# EAGLE design Micromirror_Ampli_PCB (EAGLE 9.2.2)
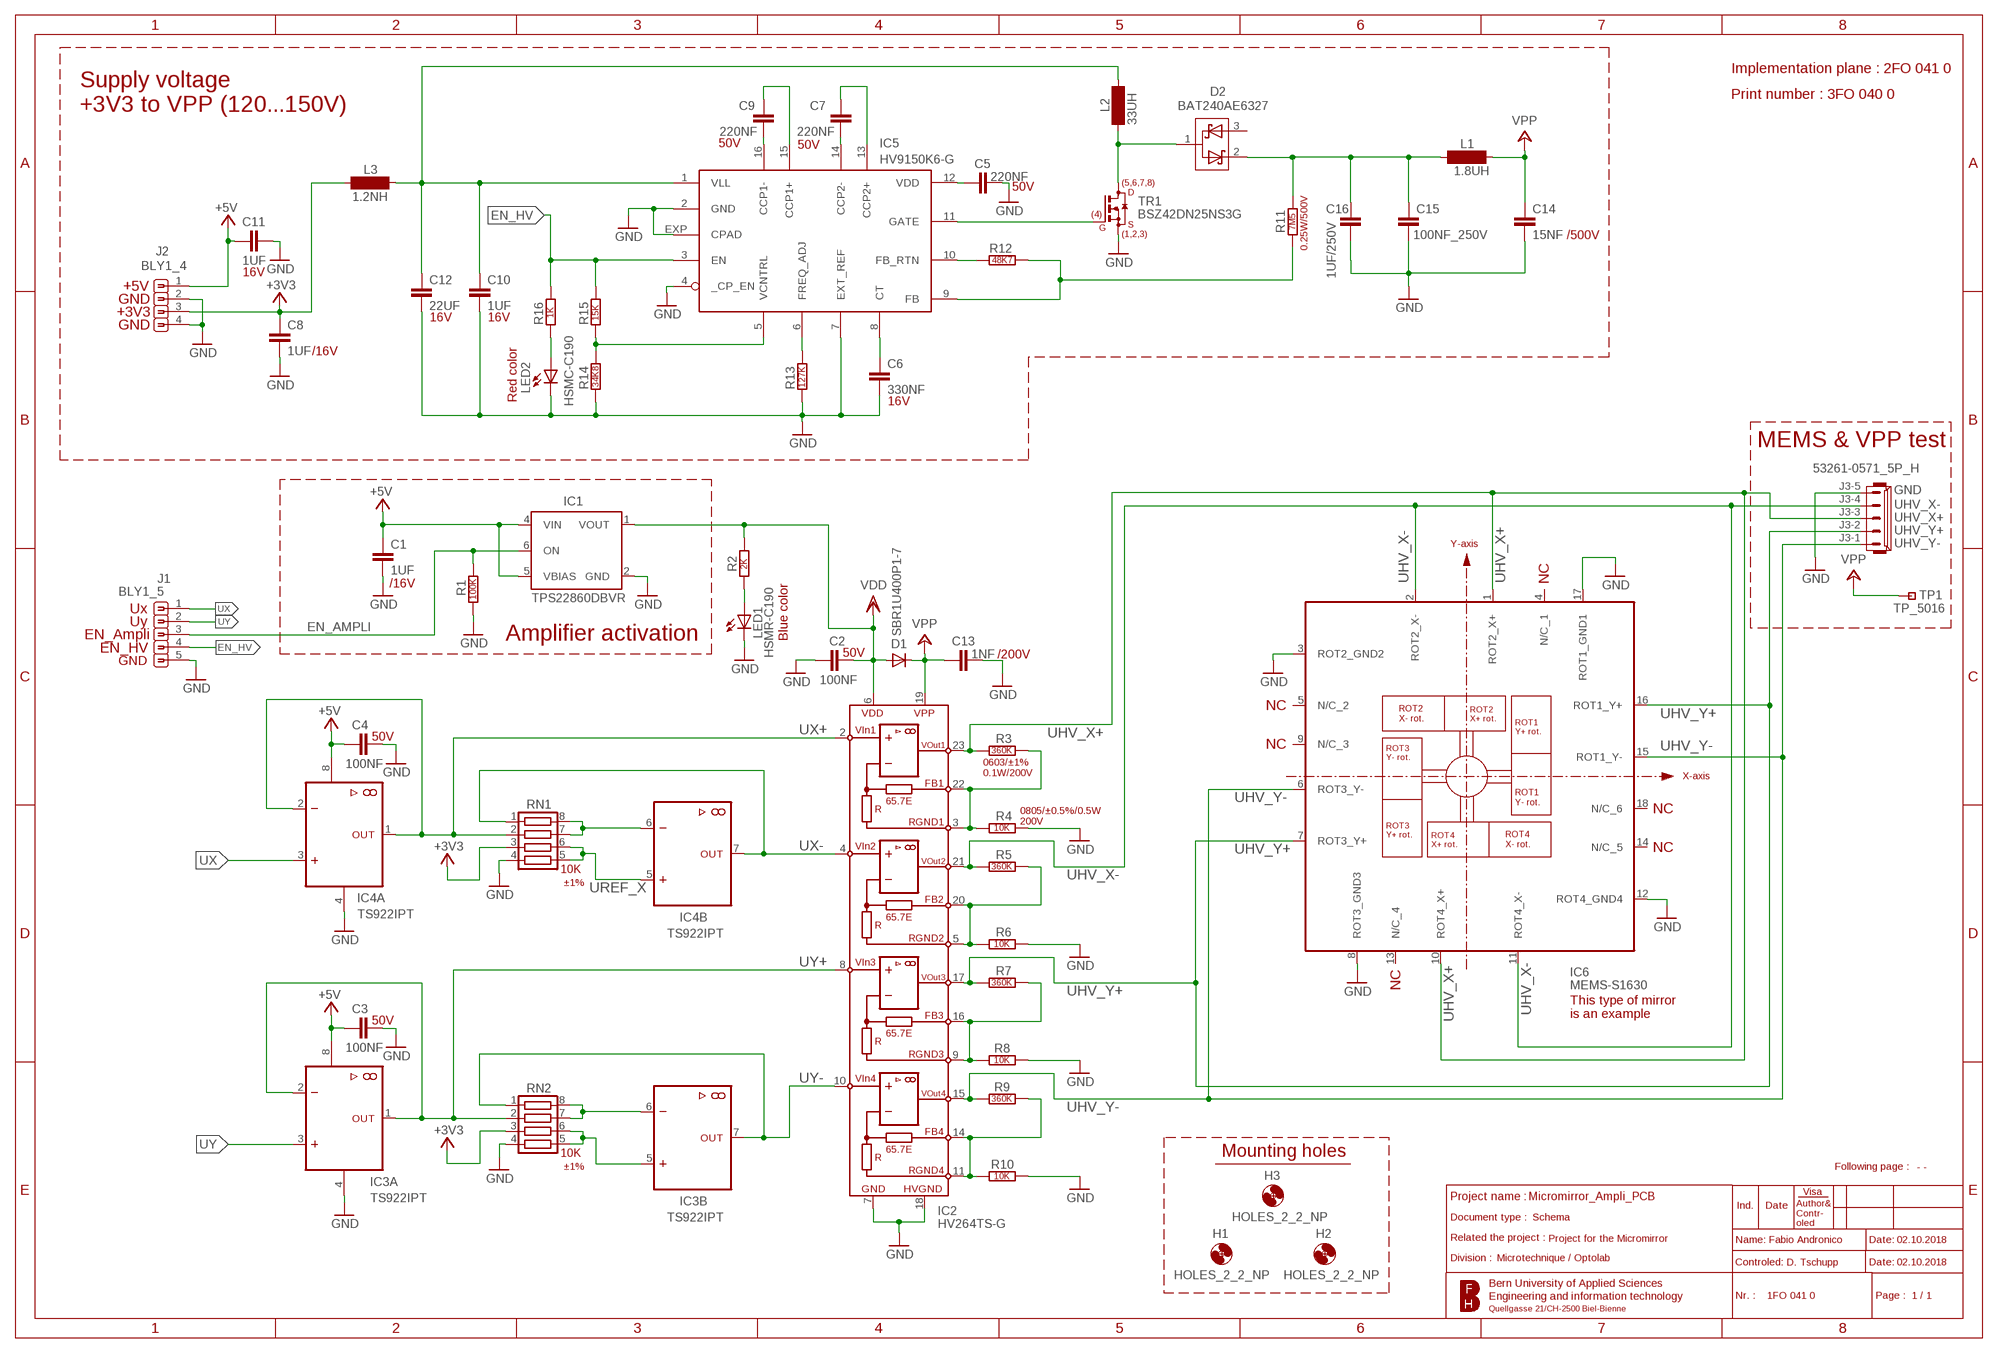
[diagram p0: schematic, sheet 1]

## Parts
C1  1UF  [C0603]
C2  100NF  [C0603]
C3  100NF  [C0603]
C4  100NF  [C0603]
C5  220NF  [C0603]
C6  330NF  [C0603]
C7  220NF  [C0603]
C8  1UF  [C0603]
C9  220NF  [C0603]
C10  1UF  [C0603]
C11  1UF  [C0603]
C12  22UF  [C0805]
C13  1NF  [C0603]
C14  15NF  [C0805]
C15  100NF_250V  [C0805]
C16  1UF/250V  [C1812]
D1  SBR1U400P1-7  [POWERDI_123]
D2  BAT240AE6327  [SOT23-3]
H1  HOLES_2_2_NP  [2_2_NP]
H2  HOLES_2_2_NP  [2_2_NP]
H3  HOLES_2_2_NP  [2_2_NP]
IC1  TPS22860DBVR  [SOT23-6]
IC2  HV264TS-G  [TSSOP24]
IC3  TS922IPT  [TSSOP8]
IC4  TS922IPT  [TSSOP8]
IC5  HV9150K6-G  [QFN16]
IC6  MEMS-S1630  [LCC18]
J1  BLY1_5  [BLY1_5_2MM]
J2  BLY1_4  [BLY1_4_2MM]
J3  53261-0571_5P_H  [53261-05]
L1  1.8UH  [L0805]
L2  33UH  [NR5040]
L3  1.2NH  [L08051R2CEWTR]
LED1  HSMR-C190  [CHIP-LED-0603]
LED2  HSMC-C190  [CHIP-LED-0603]
R1  100K  [R0603]
R2  2K  [R0603]
R3  360K  [R0603]
R4  10K_0.5%  [R0805]
R5  360K  [R0603]
R6  10K_0.5%  [R0805]
R7  360K  [R0603]
R8  10K_0.5%  [R0805]
R9  360K  [R0603]
R10  10K_0.5%  [R0805]
R11  7M5  [R1206]
R12  48K7  [R0603]
R13  127K  [R0603]
R14  34K8  [R0603]
R15  15K  [R0603]
R16  1K_0.1W  [R0603]
RN1  10K  [RN1206]
RN2  10K  [RN1206]
TP1  TP_5016  5016  [5016]
TR1  BSZ42DN25NS3G  [TSDSON-8]

## Nets
+3V3: C8.1 J2.3 L3.1 RN1.3 RN2.3
+5V: C1.1 C3.1 C4.1 C11.1 IC1.4(VIN) IC1.5(VBIAS) IC3.8(P:+5V) IC4.8(P:+5V) J2.1
EN_AMPLI: IC1.6(ON) J1.3 R1.1
EN_HV: IC5.3(EN) J1.4 R15.2 R16.2
GND: C1.2 C2.2 C3.2 C4.2 C5.1 C6.2 C8.2 C10.2 C11.2 C12.2 C13.2 C14.2 C15.2 C16.2 IC1.2(GND) IC2.7(GND) IC2.18(HVGND) IC3.4(P:GND) IC4.4(P:GND) IC5.2(GND) IC5.4(_CP_EN) IC5.7(EXT_REF) IC5.EXP(CPAD) IC6.3(ROT2_GND2) IC6.8(ROT3_GND3) IC6.12(ROT4_GND4) IC6.17(ROT1_GND1) J1.5 J2.2 J2.4 J3.5 LED1.C LED2.C R1.2 R4.2 R6.2 R8.2 R10.2 R13.1 R14.1 RN1.4 RN2.4 TR1.1(S) TR1.2(S) TR1.3(S)
N$1: IC5.11(GATE) TR1.4(G)
N$2: C9.1 IC5.16(CCP1-)
N$3: C9.2 IC5.15(CCP1+)
N$4: C7.2 IC5.14(CCP2-)
N$5: C7.1 IC5.13(CCP2+)
N$6: C5.2 IC5.12(VDD)
N$7: IC5.5(VCNTRL) R14.2 R15.1
N$8: IC5.6(FREQ_ADJ) R13.2
N$9: C6.1 IC5.8(CT)
N$10: D2.1 L2.1 TR1.5(D)
N$11: IC5.10(FB_RTN) R12.1
N$12: C15.1 C16.1 D2.2 L1.1 R11.2
N$13: IC5.9(FB) R11.1 R12.2
N$14: IC3.6(B:-IN) RN2.7 RN2.8
N$15: IC3.5(B:+IN) RN2.5 RN2.6
N$16: LED2.A R16.1
N$17: IC2.3(RGND1) IC2.22(FB1) R3.2 R4.1
N$18: IC4.6(B:-IN) RN1.7 RN1.8
N$19: IC2.5(RGND2) IC2.20(FB2) R5.2 R6.1
N$20: LED1.A R2.1
N$21: C10.1 C12.1 IC5.1(VLL) L2.2 L3.2
N$22: IC2.9(RGND3) IC2.16(FB3) R7.2 R8.1
N$23: IC2.11(RGND4) IC2.14(FB4) R9.2 R10.1
UHV_X+: IC2.23(VOUT1) IC6.1(ROT2_X+) IC6.10(ROT4_X+) J3.3 R3.1
UHV_X-: IC2.21(VOUT2) IC6.2(ROT2_X-) IC6.11(ROT4_X-) J3.4 R5.1
UHV_Y+: IC2.17(VOUT3) IC6.7(ROT3_Y+) IC6.16(ROT1_Y+) J3.2 R7.1
UHV_Y-: IC2.15(VOUT4) IC6.6(ROT3_Y-) IC6.15(ROT1_Y-) J3.1 R9.1
UREF_X: IC4.5(B:+IN) RN1.5 RN1.6
UX: IC4.3(A:+IN) J1.1
UX+: IC2.2(+VIN1) IC4.1(A:OUT) IC4.2(A:-IN) RN1.2
UX-: IC2.4(+VIN2) IC4.7(B:OUT) RN1.1
UY: IC3.3(A:+IN) J1.2
UY+: IC2.8(+VIN3) IC3.1(A:OUT) IC3.2(A:-IN) RN2.2
UY-: IC2.10(+VIN4) IC3.7(B:OUT) RN2.1
VDD: C2.1 D1.A IC1.1(VOUT) IC2.6(VDD) R2.2
VPP: C13.1 C14.1 D1.C IC2.19(VPP) L1.2 TP1.1(P)
Unconnected: D2.3 IC1.3(NC) IC2.1(NC) IC2.12(NC) IC2.13(NC) IC2.24(NC) IC6.4(N/C_1) IC6.5(N/C_2) IC6.9(N/C_3) IC6.13(N/C_4) IC6.14(N/C_5) IC6.18(N/C_6)

## Notes on the sheet
- Implementation plane : 2FO 041 0
- Print number : 3FO 040 0
- Supply voltage
  +3V3 to VPP (120...150V)
- 50V | 50V
- 50V
- /500V
- 0.25W/500V
- 16V
- +5V
- GND
- +3V3
- 16V | 16V
- GND
- /16V
- Red color | 16V
- MEMS & VPP test
- NC
- /16V
- Ux
- Uy
- EN_Ampli | Amplifier activation | Blue color
- EN_HV
- 50V | /200V
- GND
- NC
- 50V
- NC
- 0603/±1%
  0.1W/200V
- NC
- 0805/±0.5%/0.5W
  200V
- NC
- ±1%
- NC
- This type of mirror
  is an example
- 50V
- Mounting holes
- ±1% | - -
- Project for the Micromirror | Fabio Andronico | 02.10.2018
- Microtechnique / Optolab
- D. Tschupp | 02.10.2018
- 1FO 041 0 | 1 / 1

## Library data of the parts
C1 C8 C10 C11 = Micromirror_Ampli_PCB:1UF: Multilayer Ceramic Capacitor, MLCC, 1uF ±5%, 16VDC, X7R, KEMET , Case 0603, Mouser: 80-C0603X105J4R; CASE: 0603; CERAMIC: X7R; FARNELL: 2860291; MANUFACTURER: KEMET; MOUSER: 80-C0603X105J4R; OPERATING_TEMPERATURE_RANGE: -55°C ~ 125°C; TOLERANCE: ±5%; TYPE: C0603X105J4RACTU; U_NOM: 16V
C2-C4 = Micromirror_Ampli_PCB:100NF: Multilayer Ceramic Capacitors MLCC, SMD 100nF ±10%, 50VDC, X7R, Kemet, Case 0603, Mouser: 80-C0603X104K5RAUTO; CASE: 0603; CERAMIC: X7R; DIGI-KEY: 399-6912-1-ND; DISTRELEC: 300-31-697; MANUFACTURER: Kemet; MOUSER: 80-C0603X104K5RAUTO; OPERATING_TEMPERATURE_RANGE: -55°C ~ 125°C; TOLERANCE: ±10%; TYPE: C0603X104K5RACAUTO; U_NOM: 50V
C5 C7 C9 = Micromirror_Ampli_PCB:220NF: Multilayer ceramic capacitor SMD, 220nF, ±10%, 50VDC, X7R, Murata, Case 0603, Mouser: 81-GCJ188R71H224KA1D; CASE: 0603; CERAMIC: X7R; DIGI-KEY: 490-14410-1-ND; MANUFACTURER: Murata; MOUSER: 81-GCJ188R71H224KA1D; OPERATING_TEMPERATURE_RANGE: -55°C ~ 125°C; TOLERANCE: ±10%; TYPE: GCJ188R71H224KA01D; U_NOM: 50V
C6 = Micromirror_Ampli_PCB:330NF: Ceramic capacitor SMD 330nF ±10%, 16VDC, X7R, AVX, Case 0603, Mouser: 581-0603YC334KAT2A; CASE: 0603; CERAMIC: X7R; DIGI-KEY: 478-10817-1-ND; MANUFACTURER: AVX; MOUSER: 581-0603YC334KAT2A; OPERATING_TEMPERATURE_RANGE: -55°C ~ 125°C; TOLERANCE: ±10%; TYPE: 0603YC334KAT2A; U_NOM: 16V
C12 = Micromirror_Ampli_PCB:22UF: Multilayer ceramic capacitor MLCC, SMD, 22uF, ±20%, 16VDC, X5R, Murata, Case 0805, Mouser : 81-GRM219R61C226ME5L; CASE: 0805; CERAMIC: X5R; DIGI-KEY: 490-9952-1-ND; FARNELL: 2611932; MANUFACTURER: Murata; MOUSER: 81-GRM219R61C226ME5L; OPERATING_TEMPERATURE_RANGE: -55°C ~ 85°C; TOLERANCE: ±20%; TYPE: GRM219R61C226ME15L; U_NOM: 16VDC
C13 = Micromirror_Ampli_PCB:1NF: Ceramic capacitor SMD 1nF ±5%, 200VDC, COG, Kemet, Case 0603, Mouser:80-C0603X102J2GAUTO; CASE: 0603; CERAMIC: COG/NPO; DIGI-KEY: 399-11586-1-ND; FARNELL: 2426913; MANUFACTURER: Kemet; MOUSER: 80-C0603X102J2GAUTO; OPERATING_TEMPERATURE_RANGE: -55°C ~ 125°C; TOLERANCE: ±5%; TYPE: C0603X102J2GACAUTO; U_NOM: 200V
C14 = Micromirror_Ampli_PCB:15NF: Multilayer ceramic capacitor MLCC-SMD, 15nF, ±5%, 500VDC, X7R , Kemet, Case 0805, Mouser : 80-C0805W153JCRACTU; CASE: 0805; CERAMIC: X7R; MANUFACTURER: Kemet; MOUSER: 80-C0805W153JCRACTU; OPERATING_TEMPERATURE_RANGE: -55°C ~ 125°C; TOLERANCE: ±5%; TYPE: C0805W153JCRACTU; U-NOM: 500V
C15 = Micromirror_Ampli_PCB:100NF_250V: Multilayer Ceramic Capacitors MLCC, SMD 100nF ±20%, 250VDC, X7T, TDK, Case 0805, Mouser : 810-C2012X7T2E104MST; CASE: 0805; CERAMIC: X7T; FARNELL: 2576758; MANUFACTURER: TDK; MOUSER: 810-C2012X7T2E104MST; OPERATING_TEMPERATURE_RANGE: -55...+125°C; TOLERANCE: ±20%; TYPE: C2012X7T2E104M125AE; U_NOM: 250V
C16 = Micromirror_Ampli_PCB:1UF/250V: Multilayer ceramic capacitor MLCC-SMD, 1uF ±10%, 250VDC, X7T, Murata, Case 1812, Mouser : 810-C4532X7T2E105KKA; CASE: 1812; DIELECTRIC: X7T; DIGI-KEY: 445-7769-1-ND; FARNELL: 2525209; MANUFACTURER: TDK; MOUSER: 810-C4532X7T2E105KKA; OPERATING-TEMPERATURE: -55°C ~ 125°C; TOLERANCE: ±10%; TYPE: C4532X7T2E105K250KA; VOLTAGE-RATING: 250 VDC
D1 = Micromirror_Ampli_PCB:SBR1U400P1-7: Schottky Diodes & Rectifiers SBRULTRA LOW VF 1A400V, Diodes Incorporated, Mouser : 621-SBR1U400P1-7; DIGI-KEY: SBR1U400P1-7DICT-ND; FARNELL: 1863727; IF: 1A; MAX_SURGE_CURRENT: 40A; MOUSER: 621-SBR1U400P1-7; OPERATING_TEMPERATURE: -65°C à +175°C; PEAK_REVERSE_VOLTAGE: 400V; RECOVERY_TIME: 85 ns; VF: 820mV
D2 = Micromirror_Ampli_PCB:BAT240AE6327: Schottky Diodes & Rectifiers, Hi Voltage Schottky Diode, 240V, 400mA, Infineon, Mouser : 726-BAT240AE6327; CASE: SOT23-3; CONFIGURATION: Dual Series; DIGI-KEY: BAT240AE6327HTSA1CT-ND; FARNELL: 2443529; IF: 0.4A; IFSM: 1A; IR: 10 uA at 100 V; MANUFACTURER: Infineon; MOUSER: 726-BAT240AE6327; OPERATING-TEMPERATURE: -55...+125°C; PRODUCT_TYPE: Schottky Diodes & Rectifiers; TECHNOLOGY: SI; TYPE: BAT 240A E6327; VF: 0.52V; VRM: 240V
H1-H3 = Micromirror_Ampli_PCB:HOLES_2_2_NP: Hole D = 2,2mm
IC1 = Micromirror_Ampli_PCB:TPS22860: Power Switch ICs - Power Distribution Dual Slot Power Interface, SOT-23-6, Texas Instruments, Mouser : 595-TPS22860DBVR; BIAS-VOLTAGE-RANGE: 1,65 to 5,5V; CASE: SOT-23-6; DIGI-KEY: 296-43982-1-ND; MANUFACTURER: Texas Instruments; MAX-CONTINUOUS_SWITCH-CURRENT: 200mA; MOUSER: 595-TPS22860DBVR; R-ON-5V: 0,73 Ohms
IC2 = Micromirror_Ampli_PCB:HV264TS-G: Op Amps Quad High Voltage Amplifier Array IC, HV264TS-G, Case TSSOP-24, Mouser : 689-HV264TS-G; CASE: TSSOP-24; INPUT_BIAS_CURRENT_MAX: 50 nA; MANUFACTURER: Supertex; MAX_MIN_OPERATING-TEMP: -40C to +85C; MOUSER: 689-HV264TS-G; NUMBER_OF_CHANNEL: 4; OPERATING_SUPPLY_VOLTAGE: 5V; SLEW_RATE: 9 V/us
IC3 IC4 = Micromirror_Ampli_PCB:TS922: STMicroelectronics - TS922IxT , Operational Amplifier, Rail-to-Rail, Dual 2,7 V ~ 12 V, DIgi-Key : 497-6619-1-ND (TSSOP8), DIgi-Key : 497-6035-1-ND (SO8); CASE: TSSOP-8; CHANNEL: 2; CMRR: 60 dB; DIGI-KEY: 497-6619-1-ND; FARNELL: 1131996; GPB: 4 MHz; IOUT-MAX: 80mA; MOUSER: 511-TS922IP; OPERATING-TEMPERATURE: -40°C ~ 125°C; SR: 1.3 V/us; SUPPLY-CURRENT-PRO-CHANNEL: 3mA; SUPPLY-MIN-MAX: (±) 2,7 V ~ 12 V; TYPE: TS922IPT
IC5 = Micromirror_Ampli_PCB:HV9150K6-G: Switching controllers HV Output Hysteretic DC/DC Controller, Microchip, case QFN16, Mouser : 689-HV9150K6-G; CASE: QFN16; DIGI-KEY: HV9150K6-GCT-ND; DUTY_CYCLE-MAX: 87.5 %; FALL_TIME: 12 ns; INPUT_VOLTAGE: 2.7V; ISOLATION: Non-Isolated; MANUFACTURER: Microchip; MOUSER: 689-HV9150K6-G; NUMBER_OF_OUTPUT: 1; OPERATING-TEMPERATURE: -25°C ~ 125°C (TJ); OPERATING_SUPPLY_CURRENT: 2 uA; OPERATING_SUPPLY_VOLTAGE: 5V; OUTPUT_CURRENT: 100mA; OUT_POWER: 3W; OUT_TYPE: Adjustable; OUT_VOLTAGE: 500V; RISE_TIME: 36nS; SWITCHING_FREQUENCY: 400 kHz
IC6 = Micromirror_Ampli_PCB:MEMS-S1630: 4-Quadrant two-Axis actuators. Actuators rotate mirror in the positive & negative direction about the x-axis & in the positive & negative direction about the y-axis; CASE: LCC18; MANUFACTURER: mirrorcletech
J1 = Micromirror_Ampli_PCB:BLY1_5: Single row 2 mm, 5 pin's, female header, Straight, Square pin diam. 0.5 mm, Astrel : BLY 1 5; ASTREL: BLY 1 5; CLASS_OF_INFLAMMABILITY: UL 94 V-0; CONTACT_OF_MATERIAL: CuZn-alloy; DESIGN: Female header; GENDER: GENDER_HOUSING; GRID: 2mm; INSERT_DEPTH: 2.5...3.8mm; INSULATING_BODY_MATERIAL: PA 4.6. GF; MANUFACTURER: Fischer Elektronik; NOMINAL_CURRENT: 2.5A; NOMINAL_VOLTAGE: 100 VDC; OPERATING_TEMPERATURE: -40°C... +163°C; PLUGABILITY: Ø0,4...0,56mm; PLUG_IN_CROSS_SECTION: Ø0,5mm; SURFACE_CONTACT: Ni+4...6µm Sn
J2 = Micromirror_Ampli_PCB:BLY1_4: Single row 2 mm, 4 pin's, female header, Straight, Square pin diam. 0.5 mm, Astrel : BLY 1 4; ASTREL: BLY 1 4; CLASS_OF_INFLAMMABILITY: UL 94 V-0; CONTACT_OF_MATERIAL: CuZn-alloy; DESIGN: Female header; GENDER_HOUSING: Female; GRID: 2mm; INSERT_DEPTH: 2.5...3.8mm; INSULATING_BODY_MATERIAL: PA 4.6. GF; MANUFACTURER: Fischer Elektronik; NOMINAL_CURRENT: 2.5A; NOMINAL_VOLTAGE: 100 VDC; OPERATING_TEMPERATURE: -40°C... +163°C; PLUGABILITY: Ø0,4...0,56mm; PLUG_IN_CROSS_SECTION: Ø0,5mm; SURFACE_CONTACT: Ni+4...6µm Sn
J3 = Micromirror_Ampli_PCB:53261-0571_5P_H: Pin header, PicoBlade 5-pin SMD, 53261-0571, Molex, single row 90°, Distrelec : 143-54-304; CABLE_ASSEMBLY_31565: Distrelec : 143-54-490; CONTACT_MATERIAL: Tin-plated phosphor bronze; CONTACT_RESISTANCE: 20mOhm; CRIMP_SOCKET_FEMALE_32-28AWG_50058-8100: Distrelec : 143-00-962; CRIMP_SOCKET_FEMALE__28-26AWG_50079-8100: Distrelec : 143-00-964; DESIGN: Pin strip, single row 90° SMD; DISTRELEC: 143-54-304; MANUFACTURER: Molex; MOUSER: 538-53261-0571; PITCH: 1,25mm; POLE_NO: 5; RATED_CURRENT: 1A; RATED_VOLTAGE: 125VAC; SERIES: PicoBlade; SOCKET_51021-0500: Distrelec : 143-54-395
L1 = Micromirror_Ampli_PCB:1.8UH: Fixed Inductors, 1800nH, 0.6ohms, 50mA, case 0805, Laird, Mouser : 875-IC0805B182R-10; APPLICATION: RF; CASE: 0805; DIGI-KEY: IC0805B182R-10-ND; INDUCTANCE: 1.8uH; MANUFACTURER: Laird; MAX_DC_CURRENT: 250mA; MAX_DC_RESISTANCE: 600 mOhms; MOUSER: 875-IC0805B182R-10; SELF_RESONANT_FREQUENCY: 55 MHz
L2 = Micromirror_Ampli_PCB:33UH: Fixed inductor 33uH ±20% 1,2A 234uOhms, NR5040T330M,Taiyo Yuden, Case SMD : NR5040, Mouser : 963-NR5040T330M; DIGI-KEY: 587-2370-1-ND; FARNELL: 2860584; MANUFACTURER: Taiyo Yuden; MAX_DC_CURRENT: 1.2A; MAX_DC_RESISTANCE: 234 uOhms; MOUSER: 963-NR5040T330M; OPERATING-TEMPERATURE: -25 °C ~ 120 °C; PRODUCT_TYPE: Fixed Inductors; SATURATION_CURRENT: 1.3A; SELF_RESONANT_FREQUENCY: 7 MHz; TOLERANCE: ±20%
L3 = Micromirror_Ampli_PCB:1.2NH: Fixed inductor 1.2nH, ±16%, 2A, 50mOhms, L08051R2CEWTR ,AVX, case 0805, Mouser : 581-L08051R2CEW; APPLICATION: High Frequency; CASE: 0805; DIGI-KEY: L08051R2CEWTR-ND; INDUCTANCE: 1.2nH; MANUFACTURER: AVX; MAX_DC_CURRENT: 2A; MAX_DC_RESISTANCE: 50 mOhms; MOUSER: 581-L08051R2CEW; OPERATING_TEMPERATURE: -55°C ~ 125°C; SELF_RESONANT_FREQUENCY: 10 GHz; TOLERANCE: ±16%; TYPE: L08051R2CEWTR
LED1 = Micromirror_Ampli_PCB:HSMR-C190: SMD LED blue, HSMR-C190, Broadcom Limited, Package 0603, Light colour blue, Mouser : 630-HSMR-C190; CASE: 0603; COLOR: Blue; FARNELL: 1652108; IF: 20mA; LUMINOUS-INTENSITY: 55 mcd; MANUFACTURER: Broadcom Limited; MOUSER: 630-HSMR-C190; OPERATING-TEMPERATURE-RANG: -40...+85 °C; POWER-RATING: 78mW; VF: 3,4V; VIEWING-ANGLE: 140 deg; VR: 5V; WAVELENGTH: 473nm
LED2 = Micromirror_Ampli_PCB:HSMC-C190: SMD LED red, HSMR-C190, Broadcom Limited, Package 0603, Light colour red, Mouser : 630-HSMC-C190; CASE: 0603; COLOR: Red; FARNELL: 8554510; IF: 20mA; LUMINOUS-INTENSITY: 90 mcd; MANUFACTURER: Broadcom Limited; MOUSER: 630-HSMC-C190; OPERATING-TEMPERATURE-RANG: -40...+85 °C; POWER-RATING: 60mW; VF: 1,9V; VIEWING-ANGLE: 170 deg; VR: 5V; WAVELENGTH: 637nm
R1 = Micromirror_Ampli_PCB:100K: ±Resistor SMD 100 kΩ 1 %, RK73H1JTTD1003F, KOA, Case 0603, Distrelec:728261; CASE: 0603; DISTRELEC: 728261; MANUFACTURER: KOA; MOUSER: 660-RK73H1JTTD1003F; POWER: 0,1W; TEMPERATURE_COEFFICIENT: 100 ppm/°C; TOLERANCE: ±1%; TYPE: RK73H1JTTD1003F; VOLTAGE: 50VDC
R2 = Micromirror_Ampli_PCB:2K: ±Resistor SMD 2 kΩ 1 %, RK73H1JTTD2001F, KOA, Case 0603, Distrelec:728220; CASE: 0603; DISTRELEC: 728220; MANUFACTURER: KOA; MOUSER: 660-RK73H1JTTD2001F; POWER: 0,1W; TEMPERATURE_COEFFICIENT: 100 ppm/°C; TOLERANCE: ±1%; TYPE: RK73H1JTTD2001F; VOLTAGE: 50VDC
R3 R5 R7 R9 = Micromirror_Ampli_PCB:360K: ±Resistor SMD 360 kΩ 1 %, MCHVR03FTEX3603 , Multicomp, Case 0603, Farnell : 2825637; CASE: 0603; FARNELL: 2825637; MANUFACTURER: Multicomp; POWER: 0,1W; TEMPERATURE_COEFFICIENT: 100 ppm/°C; TOLERANCE: ±1%; TYPE: MCHVR03FTEX3603; VOLTAGE: 200VDC
R4 R6 R8 R10 = Micromirror_Ampli_PCB:10K_0.5%: ±Resistor SMD 10 kΩ 0.5 %, SG73G2ATTD1002D, KOA, Case 0805, Mouser : 660-SG73G2ATTD1002D; CASE: 0805; MANUFACTURER: KOA; MOUSER: 660-SG73G2ATTD1002D; POWER: 0.5W; TOLERANCE: ±0.5%; TYPE: SG73G2ATTD1002D; VOLTAGE: 200VDC
R11 = Micromirror_Ampli_PCB:7M5: Thick film resistor SMD, 7.5 MΩ, 1 %, HV732BTTD7504F, KOA, Case 1206, Mouser : 660-HV732BTTD7504F; CASE: 1206; MANUFACTURER: KOA; MOUSER: 660-HV732BTTD7504F; POWER: 0,25W; TEMPERATURE_COEFFICIENT: ±100 ppm/°C; TOLERANCE: ±1%; TYPE: HV732BTTD7504F; VOLTAGE: 500VDC
R12 = Micromirror_Ampli_PCB:48K7: ±Resistor SMD 48,7 kΩ 1 %, ERJ-3EKF4872V, Panasonic, Case 0603, Mouser : 667-ERJ-3EKF4872V; CASE: 0603; FARNELL: 2303214; MANUFACTURER: Panasonic; MOUSER: 667-ERJ-3EKF4872V; POWER: 0,1W; TEMPERATURE_COEFFICIENT: 100 ppm/°C; TOLERANCE: ±1%; TYPE: ERJ-3EKF4872V; VOLTAGE: 75VDC
R13 = Micromirror_Ampli_PCB:127K: ±Resistor SMD 127 kΩ 1 %, RC0603FR-07127KL, Yageo, Case 0603, Mouser : 603-RC0603FR-07127KL; CASE: 0603; MANUFACTURER: Yageo; MOUSER: 603-RC0603FR-07127KL; POWER: 0,1W; TEMPERATURE_COEFFICIENT: 100 ppm/°C; TOLERANCE: ±1%; TYPE: RC0603FR-07127KL; VOLTAGE: 75VDC
R14 = Micromirror_Ampli_PCB:34K8: ±Resistor SMD 34.8 kΩ, 1 %, ERJ-3EKF3482V, Panasonic, Case 0603, Mouser : 667-ERJ-3EKF3482V; CASE: 0603; DISTRELEC: 300-51-421; FARNELL: 2059457; MANUFACTURER: Panasonic; MOUSER: 667-ERJ-3EKF3482V; OPERATING-TEMPERATURE: -55 °C ~ 155 °C; POWER: 0,1W; TEMPERATURE_COEFFICIENT: 100 ppm/°C; TOLERANCE: ±1%; TYPE: ERJ-3EKF3482V; VOLTAGE: 75VDC
R15 = Micromirror_Ampli_PCB:15K: Thick film resistor SMD, 15 kΩ, 0.1 %, 0.2W, ERJ-PB3B1502V, Panasonic, Case 0603, Mouser : 667-ERJ-PB3B1502V; CASE: 0603; DIGI-KEY: P20104CT-ND; MANUFACTURER: Panasonic; MOUSER: 667-ERJ-PB3B1502V; OPERATING-TEMPERATURE: -55°C ~ 155°C; POWER: 0,2W; TEMPERATURE_COEFFICIENT: 50 ppm/°C; TOLERANCE: ±0.1%; TYPE: ERJ-PB3B1502V; VOLTAGE: 75VDC
R16 = Micromirror_Ampli_PCB:1K_0.1W: ±Resistor SMD 1 kΩ 1 %, RK73H1JTTD1001F, KOA, Case 0603, Distrelec:728213; CASE: 0603; DISTRELEC: 728213; MANUFACTURER: KOA; MOUSER: 660-RK73H1JTTD1001F; POWER: 0,1W; TEMPERATURE_COEFFICIENT: 100 ppm/°C; TOLERANCE: ±1%; TYPE: RK73H1JTTD1001F; VOLTAGE: 50VDC
RN1 RN2 = Micromirror_Ampli_PCB:10K: tor Networks & Arrays, 10K, 1%, Concave 4 resistors, Mouser : 652-CAT16-1002F4LF; CASE: 1206; CIRCUIT-TYPE: Isolated; DISTRELEC: 300-37-054; FARNELL: 2321720; MANUFACTURER: Bourns; MOUSER: 652-CAT16-1002F4LF; NUMBER-OF-PINS: 8; NUMBER-OF-RESISTORS: 4; OPERATING-TEMPERATURE: -55°C ~ 125°C; POWER-PER-ELEMENT: 62.5 mW; POWER-TOTAL-PACKAGE: 250 mW; TEMPERATURE-COEFFICIENT: ±200ppm/°C; TOLERANCE: ±1%; VOLTAGE-RATING: 50V
TP1 = Micromirror_Ampli_PCB:5016: Testpad PQ100; DIGIKEY: 36-5016CT-ND; FARNELL: 2292858; MATERIAL: Phosphor Bronze; MOUSER: 534-5016; SMD_TYPE: 5016; TYPE: SMD / Test Point compact
TR1 = Micromirror_Ampli_PCB:BSZ42DN25NS3G: MOSFET / N-Channel, BSZ42DN25NS3 G, Infineon, Case TSDSON-8, Mouser : 726-BSZ42DN25NS3G; CASE: TSDSON-8; DIGI-KEY: BSZ42DN25NS3GATMA1CT-ND; FALL_TIME: 5 ns; FARNELL: 2443427; ID: 5A; MANUFACTURER: Infineon; MOUSER: 726-BSZ42DN25NS3G; NUMBER_OF_CHANNELS: 1 Channel; OPERATING_TEMPERATURE: -55°C ~ 150°C (TJ); PD: 33,8 W; RDS: 371 mOhms; RISE_TIME: 2 ns; TECHNOLOGY: SI; TRANSISTOR_POLARITY: N-Channel; VDS: 250 V; VGS: 20V; VGS_TH: 2 V

## Board
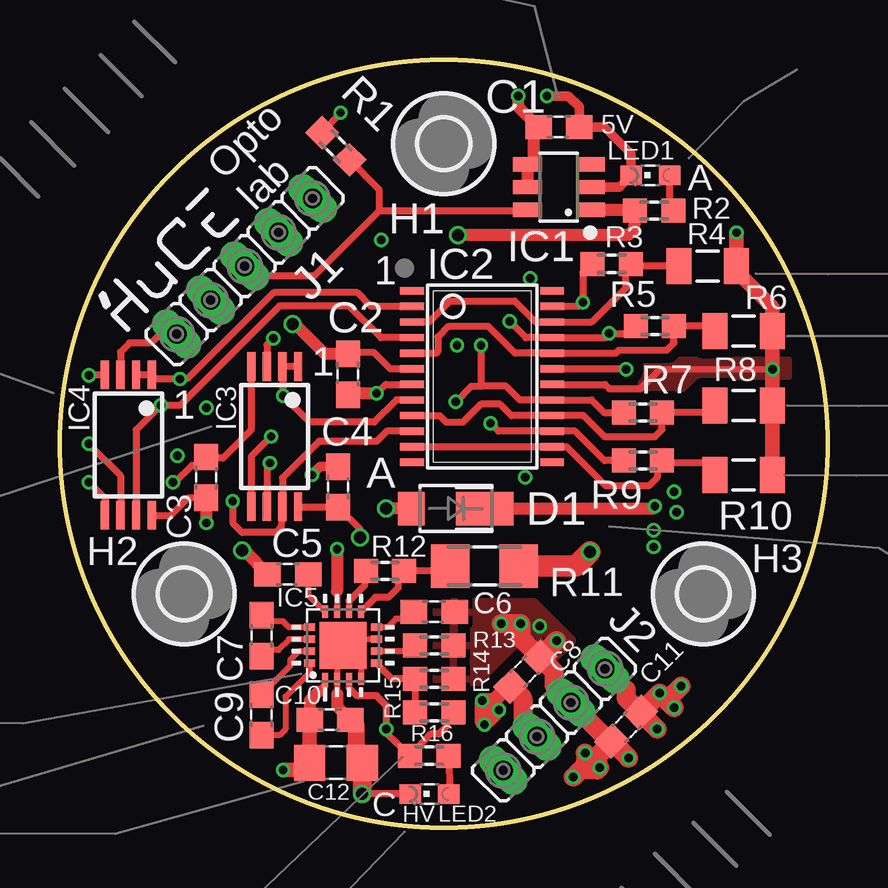
[diagram p1: board, top side]
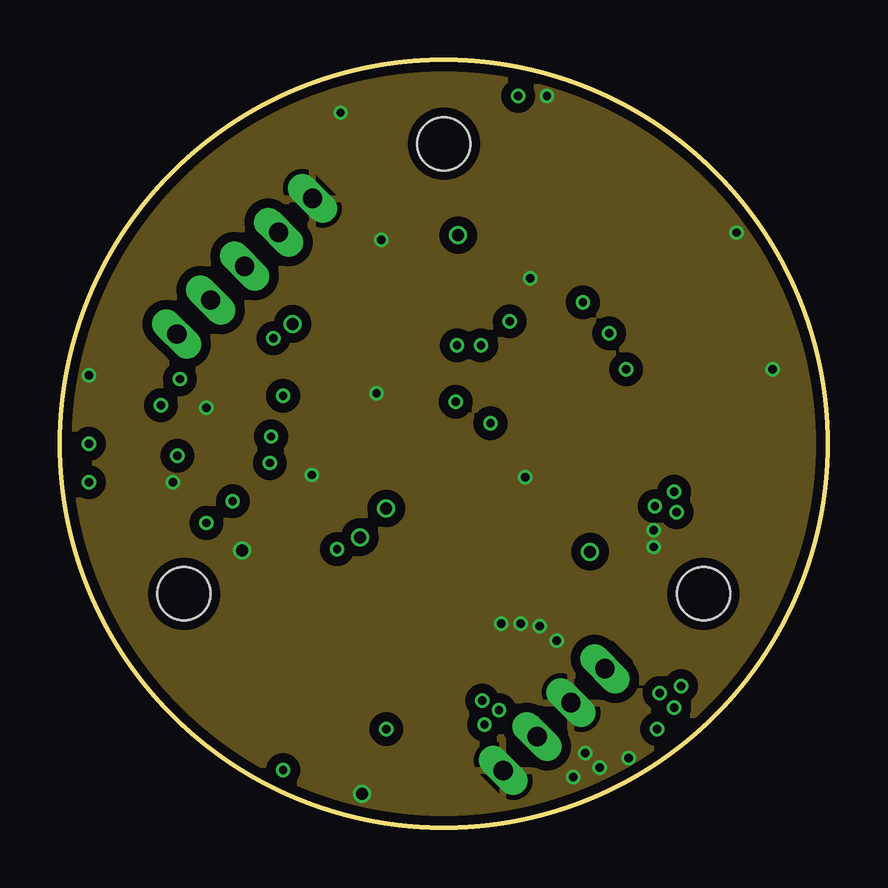
[diagram p2: board, inner layer Route2]
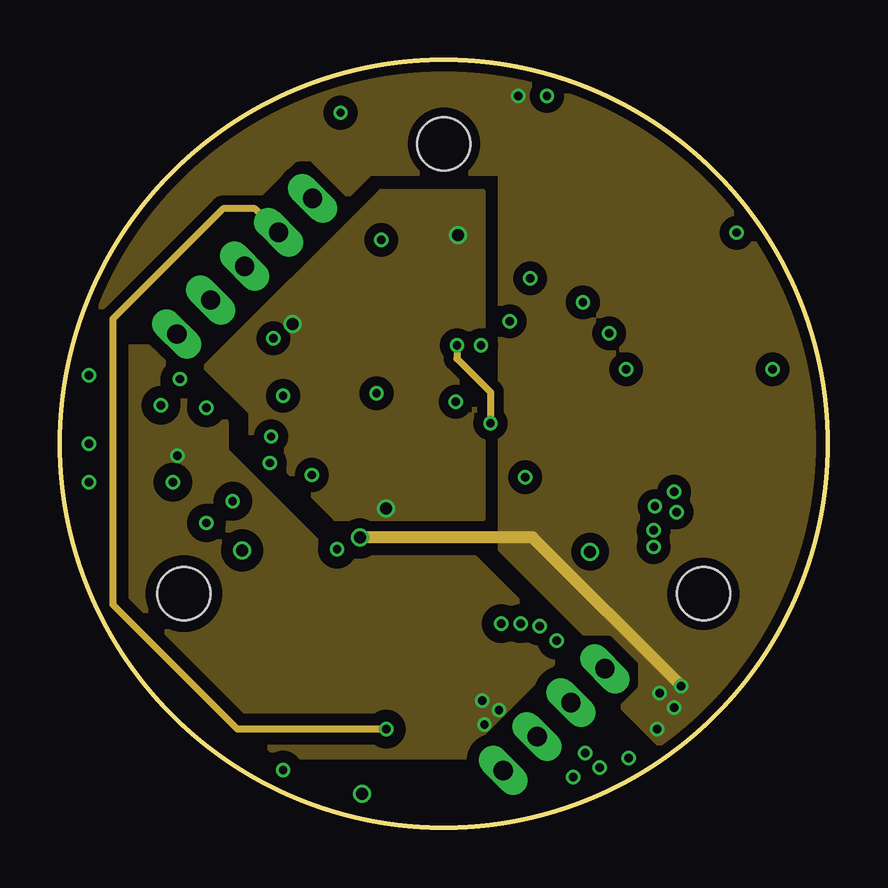
[diagram p3: board, inner layer Route3]
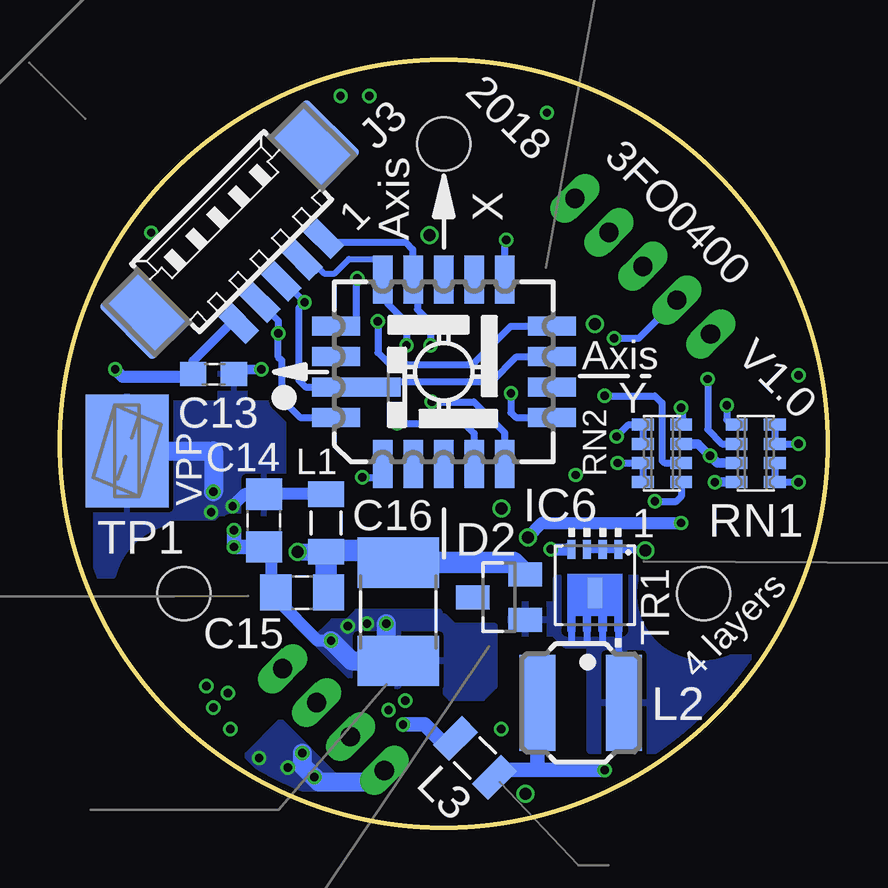
[diagram p4: board, bottom side, seen from below]

Size 32 x 32 mm. Coordinates in mm from the lower left corner, seen from the top.
Outline: circle at 16,16 radius 16
Copper layers (1+2*3+16): Top 0.018mm / dielectric 0.36mm / Route2 0.035mm / dielectric 0.71mm / Route3 0.035mm / dielectric 0.36mm / Bottom 0.018mm
Design rules "eC_4Layer_PClass6_BaseCopperO18-I35_eCDefault *": minimum track width 0.15mm, minimum drill 0.35mm, track to track 0.15mm, track to pad 0.15mm, pad to pad 0.15mm, via to via 0.15mm, smd to smd 0mil, copper to edge 0.25mm, drill to drill 0.35mm, minimum pad ring 0.175mm, minimum via ring 0.125mm, stop-mask expansion 0mil, vias tented up to drill 0.45mm, thermal gap 0.2mm

### Footprints (pad centres in the part's own frame; a part is rotated, then mirrored left to right if it is on the bottom)
C0603 = smd 1.1 x 1: 1 -0.85,0; 2 0.85,0
C0805 = smd 1.3 x 1.5: 1 -1.1,0; 2 1.1,0
C1812 = smd 2.1 x 3.4: 1 -2.05,0; 2 2.05,0
POWERDI_123 = smd 1.1 x 1.4: A -1.85,0 | smd 2.4 x 1.4: C 1.2,0
SOT23-3 = smd 1 x 1.4: 1 -0.95,-1.1; 2 0.95,-1.1; 3 0,1.1
2_2_NP = hole 2.2: 0,0
SOT23-6 = smd 0.6 x 1.2: 1 -0.95,-1.31; 2 0,-1.31; 3 0.95,-1.31; 4 0.95,1.31; 5 0,1.31; 6 -0.95,1.31
TSSOP24 = smd 0.305 x 0.991: 1 -3.575,-2.918; 2 -2.925,-2.918; 3 -2.275,-2.918; 4 -1.625,-2.918; 5 -0.975,-2.918; 6 -0.325,-2.918; 7 0.325,-2.918; 8 0.975,-2.918; 9 1.625,-2.918; 10 2.275,-2.918; 11 2.925,-2.918; 12 3.575,-2.918; 13 3.575,2.918; 14 2.925,2.918; 15 2.275,2.918; 16 1.625,2.918; 17 0.975,2.918; 18 0.325,2.918; 19 -0.325,2.918; 20 -0.975,2.918; 21 -1.625,2.918; 22 -2.275,2.918; 23 -2.925,2.918; 24 -3.575,2.918
TSSOP8 = smd 0.35 x 1.2: 1 -0.975,-2.925; 2 -0.325,-2.925; 3 0.325,-2.925; 4 0.975,-2.925; 5 0.975,2.925; 6 0.325,2.925; 7 -0.325,2.925; 8 -0.975,2.925
QFN16 = smd 0.6 x 0.3: 1 -1.45,0.75 | smd 0.5 x 0.3: 2 -1.4,0.25; 3 -1.4,-0.25; 4 -1.4,-0.75; 9 1.4,-0.75; 10 1.4,-0.25; 11 1.4,0.25; 12 1.4,0.75 | smd 0.3 x 0.5: 5 -0.75,-1.4; 6 -0.25,-1.4; 7 0.25,-1.4; 8 0.75,-1.4; 13 0.75,1.4; 14 0.25,1.4; 15 -0.25,1.4; 16 -0.75,1.4 | smd 1.95 x 1.95: EXP 0,0
LCC18 = smd 0.8 x 3.7: 1 -0.635,3.65 | smd 0.8 x 2: 2 -1.905,4.5; 8 -1.905,-4.5; 9 -0.635,-4.5; 10 0.635,-4.5; 11 1.905,-4.5; 17 1.905,4.5; 18 0.635,4.5 | smd 2 x 0.8: 3 -3.845,2.54; 4 -3.845,1.27; 5 -3.845,0; 6 -3.845,-1.27; 7 -3.845,-2.54; 12 3.845,-2.54; 13 3.845,-1.27; 14 3.845,0; 15 3.845,1.27; 16 3.845,2.54
BLY1_5_2MM = drill 0.8 long: 1 -4,0; 2 -2,0; 3 0,0; 4 2,0; 5 4,0
BLY1_4_2MM = drill 0.8 long: 1 -3,0; 2 -1,0; 3 1,0; 4 3,0
53261-05 = smd 0.8 x 1.6: 1 2.5,-2.3; 2 1.25,-2.3; 3 0,-2.3; 4 -1.25,-2.3; 5 -2.5,-2.3 | smd 2.2 x 3.2: S1 5.05,0.75; S2 -5.05,0.75
L0805 = smd 1.05 x 1.5: 1 -1.2,0; 2 1.2,0
NR5040 = smd 4 x 1.5: 1 0,1.8; 2 0,-1.8
L08051R2CEWTR = smd 0.95 x 1.7: 1 -1.15,0; 2 1.15,0
CHIP-LED-0603 = smd 0.8 x 0.9: A 0,-0.8; C 0,0.8
R0603 = smd 1 x 1: 1 -0.8,0; 2 0.8,0
R0805 = smd 1.05 x 1.5: 1 -1.2,0; 2 1.2,0
R1206 = smd 1.6 x 1.803: 1 -1.422,0; 2 1.422,0
RN1206 = smd 0.5 x 0.9: 1 -1.2,-0.8; 2 -0.4,-0.8; 3 0.4,-0.8; 4 1.2,-0.8; 5 1.2,0.8; 6 0.4,0.8; 7 -0.4,0.8; 8 -1.2,0.8
5016 = smd 4.7 x 3.45: 1 0,0
TSDSON-8 = smd 0.8 x 0.34: 1 1.5,-0.975; 2 1.5,-0.325; 3 1.5,0.325; 4 1.5,0.975 | smd 1.27 x 0.635: 5 -0.3,0

### Placement (x,y rotation side)
C1  20.8,29.2 0 top
C2  12,18.9 270 top
C3  6.1,14.6 90 top
C4  11.6,14.2 90 top
C5  9.5,10.55 0 top
C6  15.6,9 0 top
C7  8.4,8 270 top
C8  19.4,6.5 45 top
C9  8.4,4.7 90 top
C10  11.26,4.5 0 top
C11  23.6,4.2 225 top
C12  11.5,2.7 0 top
C13  25.6,18.9 180 bottom
C14  23.5,12.8 270 bottom
C15  21.9,9.8 180 bottom
C16  17.9,9 270 bottom
D1  16.5,13.3 0 top
D2  13.7,9.6 90 bottom
DRILEGEND  [DRILEGEND]  -44.32,-66.03 0 top  (outside the outline)
H1  16,28.5 0 top
H2  5.17,9.75 0 top
H3  26.83,9.75 0 top
IC1  20.8,26.7 90 top
IC2  17.6,18.8 270 top
IC3  8.95,16.3 180 top
IC4  2.85,15.95 180 top
IC5  11.8,7.6 90 top
IC6  16,19 90 bottom
J1  7.7,23.4 45 top
J2  20.6,4.5 225 top
J3  24.4,24.4 45 bottom
L1  20.9,12.7 90 bottom
L2  10.3,5.2 270 bottom
L3  14.7,2.9 315 bottom
LED1  24.61,27.19 90 top
LED2  15.4,1.4 90 top
R1  11.5,28.4 135 top
R2  24.77,25.71 180 top
R3  23,23.5 0 top
R4  27,23.4 0 top
R5  24.8,20.9 0 top
R6  28.5,20.7 0 top
R7  24.3,17.3 0 top
R8  28.5,17.6 0 top
R9  24.3,15.3 0 top
R10  28.5,14.7 0 top
R11  17.7,10.9 0 top
R12  13.55,10.7 0 top
R13  15.6,7.6 180 top
R14  15.6,6.2 180 top
R15  15.6,4.8 0 top
R16  15.4,3 180 top
RN1  3,15.6 270 bottom
RN2  6.9,15.6 90 bottom
TP1  29.2,15.7 270 bottom
TR1  9.7,10.1 90 bottom
U$2  [DIN_A4_L_LOC_LAYER_TOP]  -115.4,-81.5 0 top  (outside the outline)
U$3  [DIN_A4_L_LOC_INNERLAYER2]  -115.4,-81.5 0 top  (outside the outline)
U$4  [DIN_A4_L_LOC_SILKSCREEN_TOP]  -115.4,-81.5 0 top  (outside the outline)
U$5  [DIN_A4_L_LOC_LAYER_BOTTOM]  -115.4,-81.5 0 top  (outside the outline)
U$6  [DIN_A4_L_LOC_SILKSCREEN_BOTTOM]  -115.4,-81.5 0 top  (outside the outline)
U$7  [DIN_A4_L_LOC_INNERLAYER3]  -115.4,-81.5 0 top  (outside the outline)
U$8  [DIN_A4_L_LOC_DRILL_BFH]  -115.4,-81.5 0 top  (outside the outline)
U$9  [COUPE_4L_1,6]  -74,37.9 0 top  (outside the outline)
U$10  [DIN_A4_L_LOC_TOP_DOCU]  -115.4,-81.5 0 top  (outside the outline)
U$11  [DIN_A4_L_LOC_BOTTOM_DOCU]  -115.4,-81.5 0 top  (outside the outline)

### Tracks (layer width: path | path; a pad name or v marks a point on that pad's centre or on a via)
+3V3  (via drill 0.35)
  Top 0.6: 18.01,5.21 18,5.2 17.94,5.3 v17.6,5.3 17.6,4.4 v17.7,4.3 v18.3,4.9 18.05,5.15 18.01,5.21 | C8.1 18.7,5.9 18.01,5.21
  Top 0.8: C8.1 19.3,5.4 19.3,4.3 19.81,3.79 J2.3
  Bottom 0.4: RN1.3 4.6,15.2 v4.9,15.5 5.4,16 RN2.3
  Bottom 0.6: v17.7,4.3 16.8,4.3 16,3.5 15.73,3.5 L3.1
  pour Route3 (isolate 0.5): 17.1,3 21.3,7.2 17.3,11.2 11.4,11.2 6.9,15.7 6.9,16.9 3.8,20 2.6,20 2.6,9.5 9.1,3
+5V  (via drill 0.35, 0.5)
  Top 0.3: IC3.8 9.9,13.35 C4.1 12.5,12.45 v12.5,12.1 | C3.1 5.35,13.75 4.6,13 3.85,13 IC4.8
  Top 0.5: C3.1 v6.1,12.7 | v19.1,30.5 19.1,30.05 C1.1 19.73,29.2 19.73,27.65 IC1.4 IC1.5
  Top 0.8: C11.1 v24.9,4.1 | C11.1 v25,5.6 25.35,5.25 | v25.6,5 25.35,5.25 | v25.9,5.9 25.35,5.35 25.35,5.25 | C11.1 23.6,5.4 23.6,5.74 J2.1
  Route3 0.5: v12.5,12.1 19.7,12.1 v25.9,5.9
  Bottom 0.5: v6.1,12.7 11.9,12.7 v12.5,12.1
  pour Route3 (isolate 0.4): 0,16 arc-90 16,32 arc-90 32,16 arc-54 25.4,3.1 23.4,5.1 24.2,5.9 24.2,6.8 23,8 22.9,8 22,8 18.4,11.6 18.4,18.4 18.4,27.2 18.4,27.3 12.9,27.3 12,26.4 10.5,27.9 9.9,27.9 9.8,27.9 3,21.1 2.5,21.1 1.8,21.1 1.8,8.7 1.5,9.3 arc-28
EN_AMPLI
  Top 0.3: J1.3 8.1,23 10.6,23 13.3,25.7 | IC1.6 19.44,25.7 13.3,25.7 | R1.1 13.3,26.6 13.3,25.7
EN_HV  (via drill 0.35)
  Top 0.25: IC5.3 12.05,5.83
  Top 0.3: 12.05,5.83 12.38,5.5 13.2,5.5 13.6,5.1 v13.6,4.1 13.6,3.95 R16.2 15.45,3.9 15.8,3.9 16.1,4.2 16.1,4.45 R15.2
  Route3 0.3: J1.4 8.13,25.8 6.8,25.8 2.2,21.2 2.2,9.3 7.4,4.1 v13.6,4.1
GND  (via drill 0.35, 0.5)
  Top 0.25: 11.56,5.57 11.55,5.58 IC5.2 11.55,7.35 IC5.EXP 12,7.6 | IC5.4 12.55,7.15 12.1,7.6 12,7.6 | IC5.7 12.25,7.85 12,7.6 | v29.7,19.1 25,19.1
  Top 0.3: LED2.C v12.6,1.4 | v13.2,18.1 13.57,18.48 IC2.7 | 12.05,18.1 C2.2 | R1.2 v11.7,29.8 | v4.7,14.4 4.8,14.4 5.5,15.1 5.8,15.1 C3.2 6.15,15.4 6.8,15.4 7.97,16.57 IC3.4 | IC4.4 1.12,18.88 v1.2,18.85 | IC2.18 22.73,18.48 22.9,18.3 24.2,18.3 25,19.1
  Top 0.4: v20.3,30.5 21.2,30.5 21.65,30.05 C1.2 22.7,29.2 23.81,28.09 LED1.C 23.32,26.7 IC1.2 | C4.2 10.85,15.05 v10.5,14.7
  Top 0.5: 11.56,5.57 11.56,5.05 C10.2 | C5.1 7.73,11.54 v7.6,11.55 | v13.2,18.1 12.05,18.1 | R4.2 28.2,23.2
  Top 0.6: C12.2 12.35,2.95 | 12.35,4.26 C10.2 | R10.2 R8.2 v29.7,19.1 R6.2 29.7,21.7 28.2,23.2 | v28.2,24.8 R4.2
  Top 0.7: 12.35,4.26 12.35,2.95
  Top 0.8: C8.2 20.6,6.5 20.6,5.91 J2.2 22.91,3.6 C11.2 | C11.2 22.4,3 22.4,2.6 v22.5,2.5 | v22.5,2.5 22.4,2.4 21.7,2.4 v21.4,2.1 | v22.5,2.5 22.1,2.5 21.9,2.7 v21.9,3.1 | C11.2 v23.7,2.9 | C8.2 19.2,7.9 v19.2,8.5 v18.4,8.5 | v20.7,7.8 C8.2 | C12.2 v12.6,1.4
  Bottom 0.3: TR1.3 TR1.2 TR1.1 7.65,11.6 v7.6,11.55 | v13.2,18.1 13.2,17.3 12.99,17.09 IC6.8 | IC6.3 18.54,14.6 v19.4,14.6 | IC6.17 19.91,20.91 19.9,20.9 19.65,21.15 19.65,22.85 v19.6,22.9 | IC6.12 13.46,24.44 v13.4,24.5
  Bottom 0.4: v4.7,14.4 RN1.4 | v6.1,17.5 RN2.4 | 26.35,18.8 C13.2 26.45,19.45 24.89,21.01 J3.5
  Bottom 0.5: v20.7,7.8 21.25,7.8 21.26,7.79 23,9.53 C15.2 23.19,9.99 23.19,11.39 C14.2 | v29.7,19.1 29.4,18.8 26.35,18.8
  Bottom 0.6: C14.2 v24.75,11.7 v24.75,12.4
  Bottom 0.8: v18.4,8.5 18.4,7.45 C16.2 19.85,6.95 v20.7,7.8 | J2.4 18.96,1.9 21.2,1.9 v21.4,2.1 21.9,2.6 v21.9,3.1
  other vias: 20,8.4
  pour Top (isolate 0.25): 15.6,9.4 15.6,6.05 17.45,6.05 19.6,8.2 20.7,7.1 21.4,7.8 19.8,9.4
  pour Bottom (isolate 0.25): 21.4,7.8 20.6,8.6 20,8.6 19.6,9 16.2,9 16.2,8.8 16,8.8 15.6,8.4 13.9,8.4 13.9,5.9 14.4,5.4 15.7,5.4 16.2,5.9 19.5,5.9
  pour Route2 (isolate 0.4): 16,0 arc-90 0,16 arc-90 16,32 arc-90 32,16 arc-90
  pour Bottom (isolate 0.25): 20.4,1.65 20.4,2 22.8,4.4 24.2,3 22.85,1.65
  pour Top (isolate 0.4): 24.2,19.4 24.2,18.3 26,18.3 26.5,18.8 30.4,18.8 30.4,19.5 25.8,19.5 25.7,19.4
N$1  (via drill 0.35)
  Top 0.25: 11.55,9.85 IC5.11
  Top 0.5: v11.55,11.6 11.55,9.85
  Bottom 0.3: 10.85,11.6 TR1.4
  Bottom 0.5: v11.55,11.6 10.85,11.6
N$2
  Top 0.25: IC5.16 10.4,6.45 9.4,5.45 9.4,4.1 9.15,3.85 C9.1
N$3
  Top 0.25: C9.2 9.6,6.75 9.6,7 9.95,7.35 IC5.15
N$4
  Top 0.25: IC5.14 9.55,7.85 9.1,7.4 8.65,7.4 C7.2
N$5
  Top 0.25: IC5.13 9.55,8.35 9.3,8.6 8.65,8.6 C7.1
N$6
  Top 0.25: IC5.12 10.35,9.7 C5.2
N$7
  Top 0.3: R15.1 R14.2 13.85,6.2 IC5.5
N$8
  Top 0.25: IC5.6 14.5,7.35 R13.2
N$9
  Top 0.25: IC5.8 13.65,8.35 14,8.7 14.45,8.7 C6.1
N$10
  Bottom 0.3: 9.38,8.3 9.38,7.77 | 10.03,8.24 10.03,7.71 | 10.68,8.26 10.68,7.73 | TR1.5 8.72,8.82 8.72,6.64 8.5,6.42 L2.1
  pour Bottom (isolate 0.25): 2.87,7.1 3.8,5.7 4.9,4.6 6.53,3.2 9.9,3.2 9.9,7.6 10.9,7.6 11.4,8.1 13.2,8.1 13.2,9.3 11.3,9.3 11.3,10.4 7.8,10.4 7.8,9.14 arc-45 7.42,8.22 6.99,7.79 arc-45 5.32,7.1
N$11
  Top 0.25: 12.05,9.45 IC5.10
  Top 0.3: 12.05,9.45 12.7,10.1 R12.1
N$12  (via drill 0.5)
  Top 0.9: R11.2 21.5,10.9 v22.1,11.5
  Bottom 0.7: v22.1,11.5 L1.1 20.7,11.5 20.65,11.55 | 18.4,11.55 C16.1 | 20.9,9.9 C15.1
  Bottom 0.9: D2.2 13.1,11.05 C16.1 | 20.65,11.55 18.4,11.55 | L1.1 20.9,9.9
N$13
  Top 0.3: IC5.9 13.15,9.6 13.7,9.6 14.1,10 14.1,10.4 R12.2 16.08,10.7 R11.1
N$14  (via drill 0.35)
  Top 0.3: IC3.6 8.62,15.07 v8.75,15.2
  Bottom 0.3: v8.75,15.2 RN2.7 RN2.8
N$15  (via drill 0.35)
  Top 0.3: v8.8,16.3 7.97,15.47 IC3.5
  Bottom 0.3: RN2.6 RN2.5 8.3,16.8 v8.8,16.3
N$16
  Top 0.3: LED2.A 16.25,1.45 R16.1
N$17
  Top 0.3: R4.1 23.9,23.4 R3.2 23.6,23.25 23.6,22.5 22.18,21.07 IC2.22 19.82,21.07 18.95,21.95 16.25,21.95 15.38,21.07 IC2.3
N$18  (via drill 0.35)
  Top 0.3: IC4.6 2.52,14.68 v1.2,16
  Bottom 0.3: v1.2,16 RN1.7 RN1.8
N$19
  Top 0.3: R6.1 27.1,20.9 R5.2 25.6,20.2 25.3,19.9 23.3,19.9 23.18,19.77 IC2.20 18.98,19.77 17.85,20.9 16.2,20.9 15.75,20.45 15.75,19.85 15.68,19.77 IC2.5
N$20
  Top 0.3: LED1.A 25.41,25.92 R2.1
N$21  (via drill 0.35)
  Top 0.25: IC5.1 11.05,5.97 10.78,5.7 10.78,5.67
  Top 0.5: 10.78,5.67 10.41,5.3 C10.1
  Top 0.6: C10.1 C12.1 10.1,2.4 v9.3,2.4
  Bottom 0.6: 12.1,2.4 v9.3,2.4 | 12.1,2.4 13.57,2.4 L3.2 | L2.2 12.1,2.4
N$22
  Top 0.3: R8.1 27,17.3 R7.2 25.1,16.6 24.8,16.3 22.7,16.3 21.82,17.18 IC2.16 18.82,17.18 18.35,17.65 17.55,17.65 16.8,16.9 16.1,16.9 15.82,17.18 IC2.9
N$23
  Top 0.3: R10.1 27.3,15.2 25.12,15.2 R9.2 24.9,15.1 24.9,14.6 24.55,14.25 22.75,14.25 21.12,15.88 IC2.14 IC2.11
N$24
  cutout Route2: 18.7,4.4 19.3,5 20.1,5 21.1,4 21.1,3.3 20.4,2.6 19.7,2.6 18.7,3.6
  cutout Route3: 17.2,3.2 21.9,7.9 22.9,7.9 24,6.8 24,5.9 19.2,1.1 18.3,1.1 17.2,2.2
  cutout Route2: 21.6,7.2 22.1,7.7 23,7.7 23.8,6.9 23.8,6 23.2,5.4 22.5,5.4 21.6,6.3
N$25
  cutout Bottom: 9.4,8.9 10,8.9 10,8.1 9.4,8.1
UHV_X+  (via drill 0.35)
  Top 0.3: IC2.23 21.62,21.73 v21.8,21.9 21.8,23.15 R3.1
  Bottom 0.3: J3.3 22.67,22.77 v21.8,21.9 22.05,21.65 22.05,18.65 21.77,18.36 IC6.1 18.23,18.36 18,18.6 14,18.6 12.96,19.64 IC6.10
UHV_X-  (via drill 0.35)
  Top 0.3: v18.75,21.1 19.43,20.43 IC2.21 22.73,20.43 v22.9,20.6 23.7,20.6 R5.1
  Bottom 0.3: J3.4 22.9,21.13 v22.9,20.6 22.9,19.62 22.75,19.48 22.75,17.85 22,17.09 IC6.2 | v18.75,21.1 18.75,19.8 18.25,19.3 14.8,19.3 13.2,20.9 IC6.11
UHV_Y+  (via drill 0.35)
  Top 0.3: v17.55,20.1 17.55,18.4 | 17.55,18.4 18.6,18.4 19.18,17.82 IC2.17 22.16,17.82 22.68,17.3 R7.1 | v16.5,17.75 17.15,18.4 17.55,18.4
  Bottom 0.25: IC6.16 18.54,23.54 18.7,23.7 19.95,23.7 20.55,23.1 21,23.1 21.56,23.66 J3.2
  Bottom 0.3: v16.5,17.75 14.75,17.75 13.46,16.46 IC6.7 | v17.55,20.1 17.55,21.05 18.34,21.84 18.34,22.64 IC6.16
UHV_Y-  (via drill 0.35)
  Top 0.3: R9.1 22.7,15.3 21.48,16.52 IC2.15 18.27,16.52 v17.95,16.85
  Route3 0.3: v17.95,16.85 17.95,18.15 16.55,19.55 v16.55,20.1
  Bottom 0.3: v17.95,16.85 15.15,16.85 14.73,16.43 IC6.6 | v16.55,20.1 16.55,21.05 17.1,21.6 17.1,22.68 IC6.15 17.3,22.82 17.3,24.1 17.6,24.4 20.86,24.4 arc90 J3.1
UREF_X  (via drill 0.35)
  Top 0.3: IC4.5 1.88,13.72 v1.2,14.4
  Bottom 0.3: v1.2,14.4 RN1.5 RN1.6
UX
  Top 0.3: J1.1 4.54,20.9 4.5,20.9 3.8,20.2 2.9,20.2 2.52,19.82 IC4.3
UX+  (via drill 0.35)
  Top 0.3: IC4.2 IC4.1 3.83,18.7 v5,18.7 5.3,18.7 8.9,22.3 12.4,22.3 12.97,21.73 IC2.2
  Bottom 0.3: RN1.2 4.4,16 5,16.6 v5,18.7
UX-  (via drill 0.35)
  Top 0.3: IC2.4 13.38,20.43 12.05,21.75 9.15,21.75 5,17.6 v4.2,17.6 3.17,16.57 IC4.7
  Bottom 0.3: v4.2,17.6 4.2,17 4,16.8 RN1.1
UY  (via drill 0.35)
  Top 0.3: IC3.3 8.62,20.12 v8.9,20.4
  Bottom 0.3: J1.2 7.87,20.4 v8.9,20.4
UY+  (via drill 0.35)
  Top 0.3: IC2.8 14.03,17.82 13.1,16.9 10.4,16.9 v9.3,18 9.28,18.02 IC3.2 IC3.1
  Bottom 0.3: RN2.2 6.8,15.2 6.9,15.3 6.9,17.7 7.2,18 v9.3,18
UY-  (via drill 0.35)
  Top 0.3: IC2.10 13.62,16.52 13.2,16.1 10.8,16.1 9.28,14.57 IC3.7 9.22,12.53 9,12.3 7.6,12.3 7.2,12.7 v7.2,13.6
  Bottom 0.3: v7.2,13.6 6.3,13.6 6.1,13.8 RN2.1
VDD  (via drill 0.5)
  Top 0.3: IC2.6 13.78,19.12 13.1,19.8 12.05,19.8 C2.1
  Top 0.5: D1.A v13.6,13.3 | v9.7,21 9.8,21 11.05,19.75 C2.1 | v16.6,24.7 23.7,24.7 23.92,24.92 R2.2 23.88,25.75 IC1.1
  pour Route3 (isolate 0.4): 17.6,12.9 11.5,12.9 8,16.4 8,17.3 6.1,19.2 13.4,26.5 17.6,26.5
VPP  (via drill 0.35)
  Top 0.3: v23.6,19.1 23.52,19.12 IC2.19
  Top 0.5: D1.C 24.7,13.3 v24.8,13.4
  Bottom 0.4: C13.1 24.55,19.1 v23.6,19.1
  Bottom 0.5: v24.8,13.4 24.3,13.9 C14.1 L1.2
  Bottom 0.8: v25.6,14 25.6,15.7 TP1.1
  other vias: 25.7,13.15
  pour Bottom (isolate 0.4): 22.7,13.1 25.4,13.1 25.6,12.9 27.4,12.9 29.8,10.5 30.5,10.5 30.5,18 27.5,18 27.5,17.7 25.3,17.7 25.3,19.2 24.3,19.2 24.3,17.7 22.7,17.7

### Text on the board
tPlace: Opto / lab
tNames: 5V | A | H1 | 1 | 1 | 1 | A | H2 | H3 | C | HV
bNames: 2018 | 3FO0400 | X | 1 | Axis | V1.0 | Axis | Y | VPP | 1 | 4 layers
Measures: Schematic number : 1FO 041 0 | Implementation plan : 2FO 041 0 | Diam. 32 | X=0 ; Y=0 | 4 | 0,3 | 0,2 | Green | Green | White | White | -- | 4 | 0,35 | Micromirror_Ampli_PCB | 1 : 1 | Project for the Micromirror | Andronico F. | 08.10.2018 | Microtechnology / Optolab | D. Tschupp | 08.10.2018 | 3FO 040 0 | 7 / 7
tDocu: Schematic number : 1FO 041 0 | Print number : 2FO 040 0 | IC1 | GND | Led1 / Blue color | EN_HV | EN_AMP | Uy | Ux | / J2 | IC4 | IC3 | D1 | IC5 | C9 | / J2 | +5V | GND | +3V3 | GND | Led2 / Red color | 2 | 1 : 1 | Project for the Micromirror | Andronico F. | 08.10.2018 | Microtechnology / Optolab | D. Tschupp | 08.10.2018 | 2FO 041 0 | 1 / 4
bDocu: Schematic number : 1FO 041 0 | Print number : 2FO 040 0 | Test Print MEMS | Y- | Y+ | X+ | J5 | X- | 5 | 4 | GND | 3 | 2 | 1 | Socket-Housing / Female 5P / 51021-0500 | VPP | Ca1 | Ca2 | This type of mirror is an example | Ca3 | Ca4 | Ca5 | J4 | 1 | Y- | Y+ | 2 | 3 | X+ | X- | 4 | 5 | GND | Cable assembly PicoBlade / Socket-Socket / L= 30cm, Molex | TR1 | C15 | C16 | D2 | 3 | 1 : 1 | 08.10.2018 | Andronico F. | Project for the Micromirror | 08.10.2018 | D. Tschupp | Microtechnology / Optolab | 2 / 4 | 2FO 041 0
PRINT_t_DOC: Schematic number : 1FO 041 0 | Implementation plan : 2FO 041 0 | Top side layer (component & solder facing) | 2 | 1 : 1 | Project for the Micromirror | Andronico F. | 08.10.2018 | Microtechnology / Optolab | D. Tschupp | 08.10.2018 | 3FO 040 0 | 1 / 7
PRINT_b_DOC: Schematic number : 1FO 041 0 | Implementation plan : 2FO 041 0 | Bottom side layer (component & solder facing) | 6 | 1 : 1 | 08.10.2018 | Andronico F. | Project for the Micromirror | 08.10.2018 | D. Tschupp | Microtechnology / Optolab | 5 / 7 | 3FO 040 0
Print_InnerLayer2: Schematic number : 1FO 041 0 | Implementation plan : 2FO 041 0 | Inner layer 2 | 3 | 1 : 1 | Project for the Micromirror | Andronico F. | 08.10.2018 | Microtechnology / Optolab | D. Tschupp | 08.10.2018 | 3FO 040 0 | 2 / 7
Print_InnerLayer3: Schematic number : 1FO 041 0 | Implementation plan : 2FO 041 0 | Inner layer 3 | 5 | 1 : 1 | 08.10.2018 | Andronico F. | Project for the Micromirror | 08.10.2018 | D. Tschupp | Microtechnology / Optolab | 4 / 7 | 3FO 040 0
Silkscreen_Top: Schematic number : 1FO 041 0 | Implementation plan : 2FO 041 0 | Silkscreen top | 4 | 1 : 1 | Project for the Micromirror | Andronico F. | 08.10.2018 | Microtechnology / Optolab | D. Tschupp | 08.10.2018 | 3FO 040 0 | 3 / 7
Silkscreen_Bottom: Schematic number : 1FO 041 0 | Implementation plan : 2FO 041 0 | Silkscreen bottom | 7 | 1 : 1 | 08.10.2018 | Andronico F. | Project for the Micromirror | 08.10.2018 | D. Tschupp | Microtechnology / Optolab | 6 / 7 | 3FO 040 0
DrillLegend: LAYER-STACK
DrillLegend_01-16: 01-16
DrillLegend_01-20: 01-20